# Altium schematic sheet DisplayLCD-RS485.SchDoc
size A0
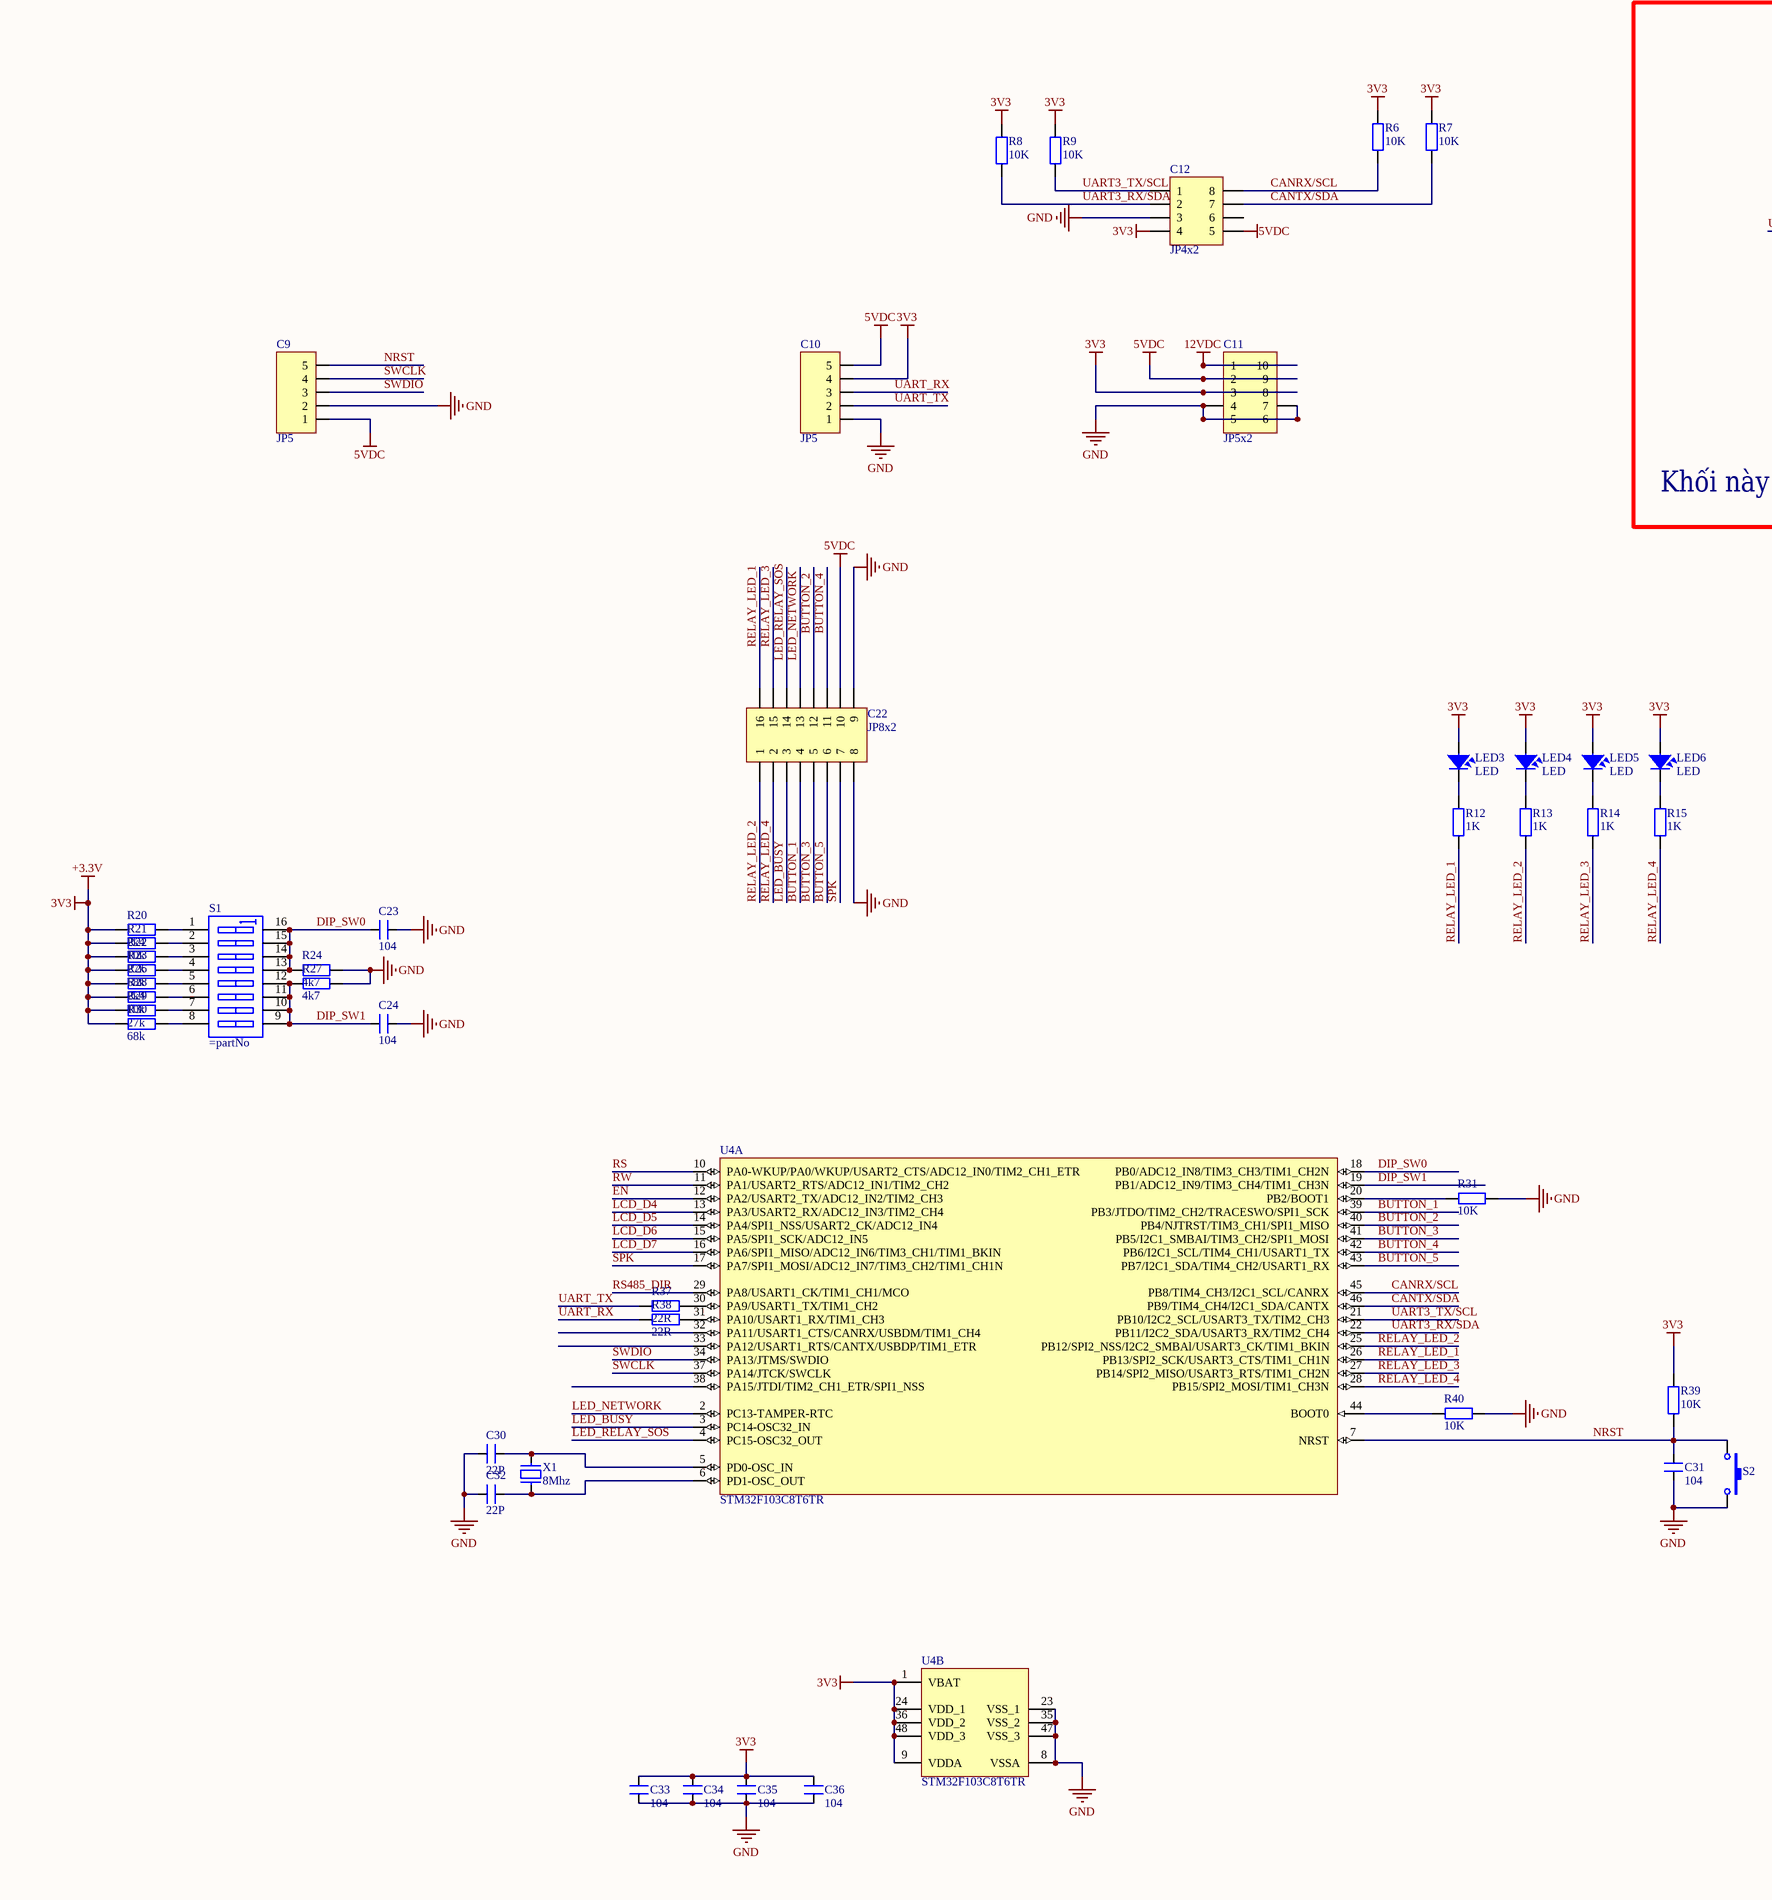
[diagram p0: DisplayLCD-RS485.SchDoc, left]
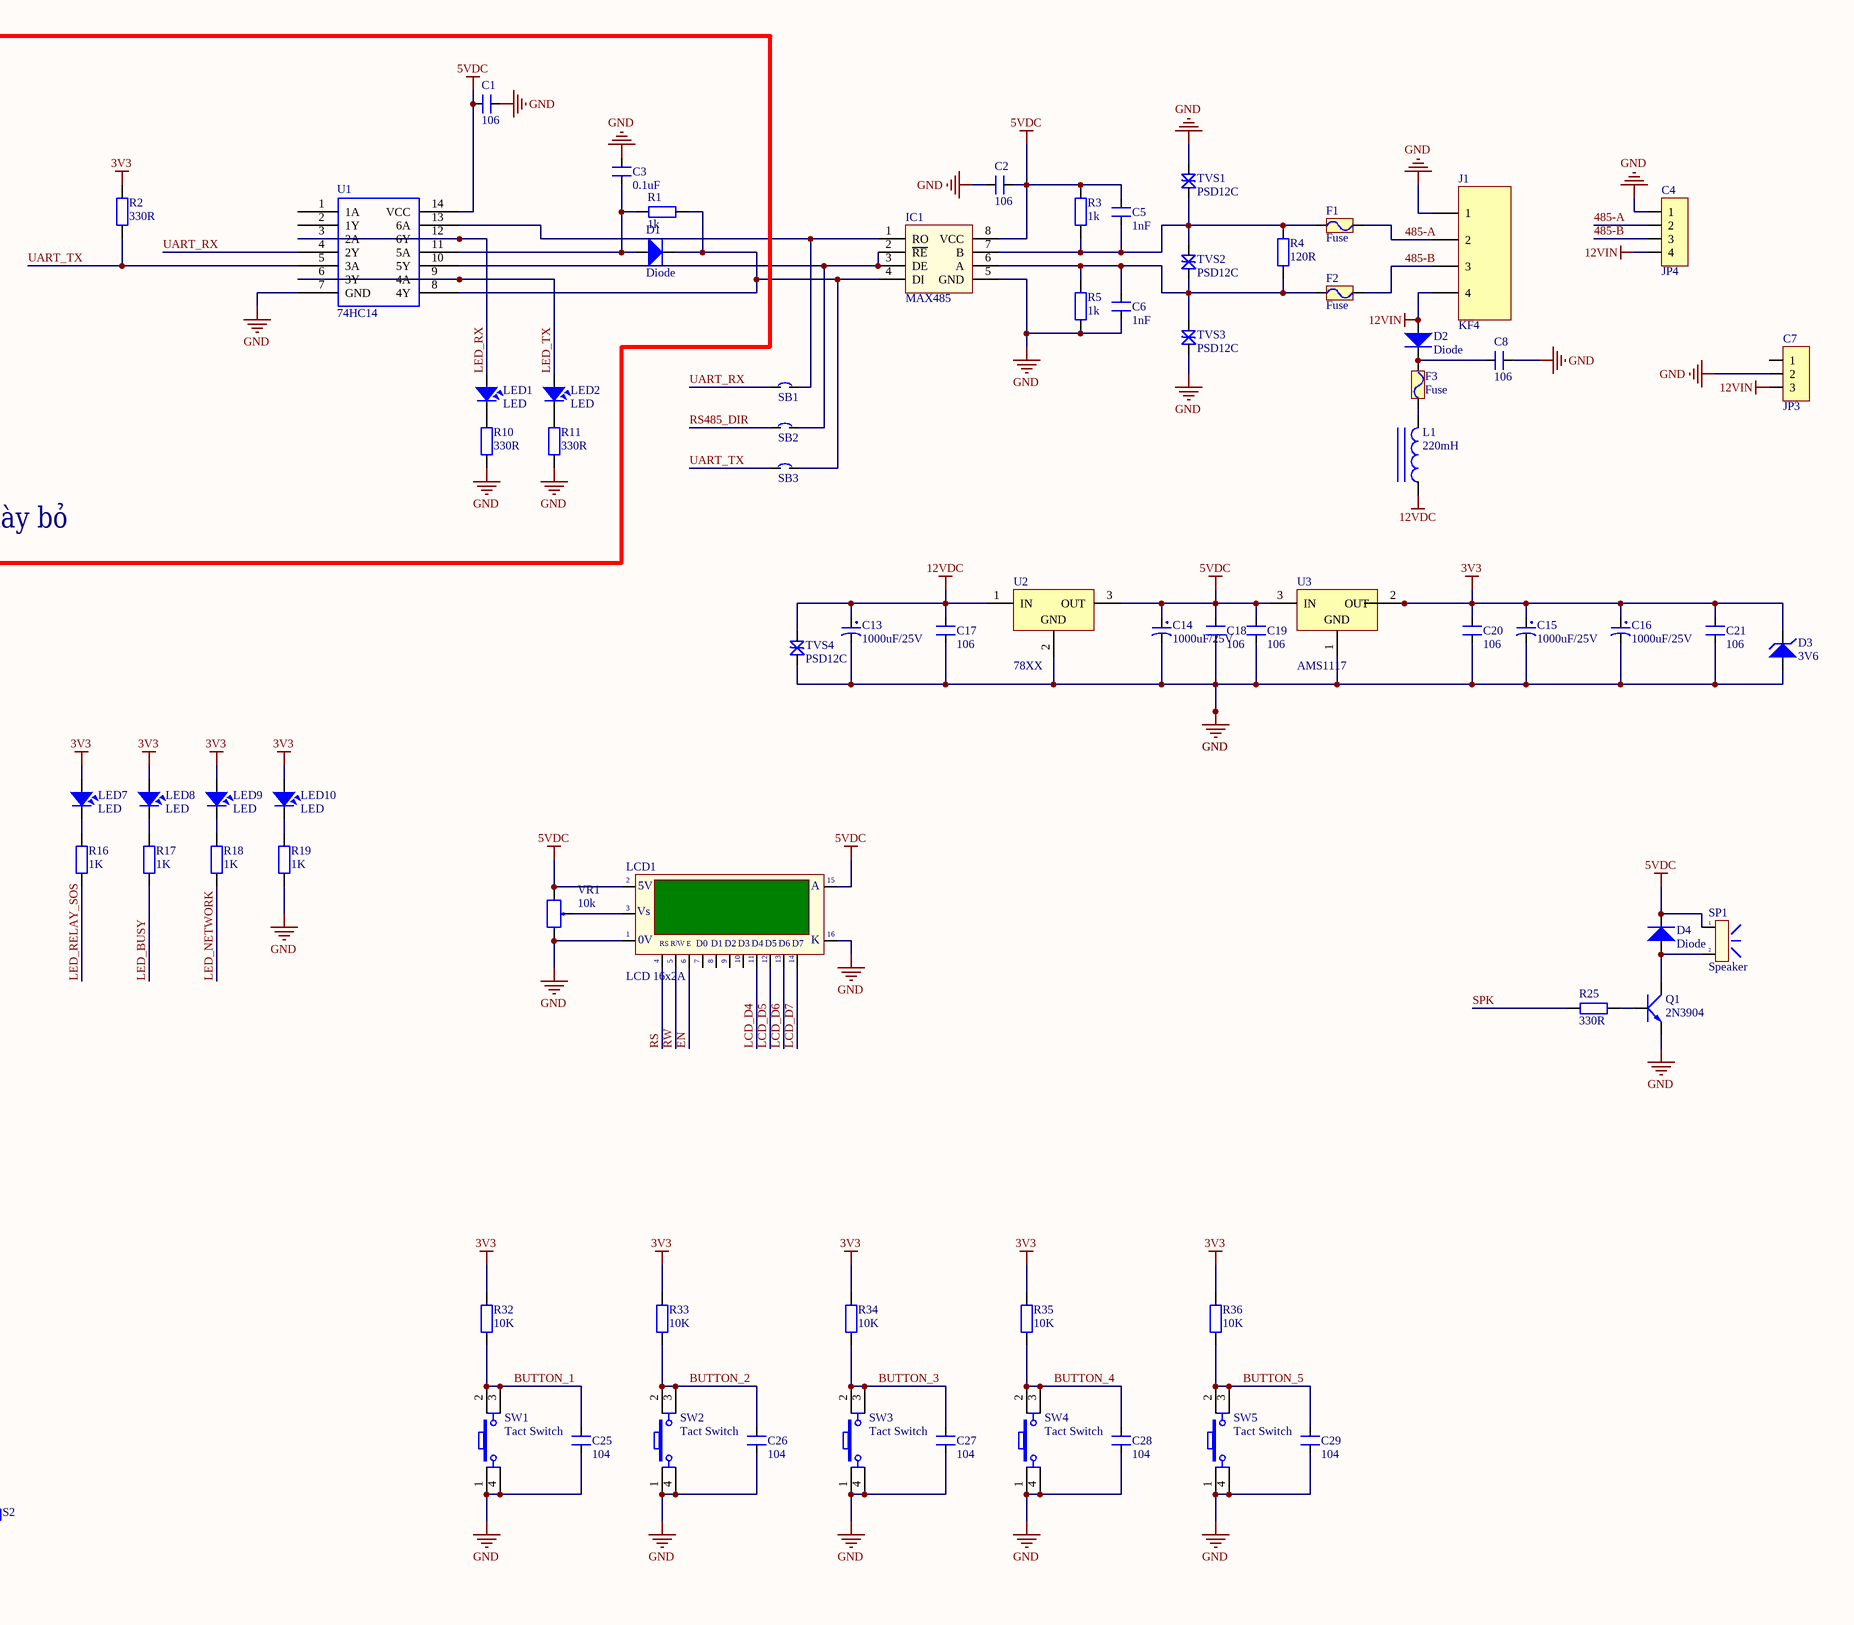
[diagram p1: DisplayLCD-RS485.SchDoc, right]

## Parts
C1  106  [SM-0805]
C2  106  [SM-0805]
C3  0.1uF  [SM-0805]
C4  JP4  [HDR2.54 4DV]
C5  1nF  [SM-0805]
C6  1nF  [SM-0805]
C7  JP3  [HDR2.54 3DV]
C8  106  [SM-0805]
C9  JP5  [JP5-C1T]
C10  JP5  [HDR2.54 5DV]
C11  JP5x2  [JP5-D2T]
C12  JP4x2  [JP4-D2T]
C13  1000uF/25V  [CP1.5/3.4]
C14  1000uF/25V  [CP1.5/3.4]
C15  1000uF/25V  [CP1.5/3.4]
C16  1000uF/25V  [CP1.5/3.4]
C17  106  [SM-0805]
C18  106  [SM-0805]
C19  106  [SM-0805]
C20  106  [SM-0805]
C21  106  [SM-0805]
C22  JP8x2  [61201621621]
C23  104  [SM-0805]
C24  104  [SM-0805]
C25  104  [SM-0805]
C26  104  [SM-0805]
C27  104  [SM-0805]
C28  104  [SM-0805]
C29  104  [SM-0805]
C30  22P  [SM-0805]
C31  104  [SM-0805]
C32  22P  [SM-0805]
C33  104  [SM-0805]
C34  104  [SM-0805]
C35  104  [SM-0805]
C36  104  [SM-0805]
D1  Diode  [DIO-SMD-106]
D2  Diode  [DIO-SMD-106]
D3  3V6  [SOD123]
D4  Diode  [DIO-SMD-106]
F1  Fuse  [RES-SMD-1812]
F2  Fuse  [RES-SMD-1812]
F3  Fuse  [RES-SMD-1812]
IC1  MAX485  [SO8]
J1  KF4  [KF4-5.08]
L1  220mH  [INDUCTOR 3A VERTICAL]
LCD1  LCD 16x2A  [LCD16X2]
LED1  LED  [SM-LED-0805-Green]
LED2  LED  [SM-LED-0805-Blue]
LED3  LED  [LED-5-BLUE]
LED4  LED  [LED-5-BLUE]
LED5  LED  [LED-5-BLUE]
LED6  LED  [LED-5-BLUE]
LED7  LED  [LED-5-BLUE]
LED8  LED  [LED-5-BLUE]
LED9  LED  [LED-5-BLUE]
LED10  LED  [LED-5-BLUE]
Q1  2N3904  [SOT23-231]
R1  1k  [RES-SMD-0805]
R2  330R  [RES-SMD-0805]
R3  1k  [RES-SMD-0805]
R4  120R  [RES-SMD-0805]
R5  1k  [RES-SMD-0805]
R6  10K  [RES-SMD-0805]
R7  10K  [RES-SMD-0805]
R8  10K  [RES-SMD-0805]
R9  10K  [RES-SMD-0805]
R10  330R  [RES-SMD-0805]
R11  330R  [RES-SMD-0805]
R12  1K  [RES-SMD-0805]
R13  1K  [RES-SMD-0805]
R14  1K  [RES-SMD-0805]
R15  1K  [RES-SMD-0805]
R16  1K  [RES-SMD-0805]
R17  1K  [RES-SMD-0805]
R18  1K  [RES-SMD-0805]
R19  1K  [RES-SMD-0805]
R20  2k4  [RES-SMD-0805]
R21  10k  [RES-SMD-0805]
R22  27k  [RES-SMD-0805]
R23  68k  [RES-SMD-0805]
R24  4k7  [RES-SMD-0805]
R25  330R  [RES-SMD-0805]
R26  2k4  [RES-SMD-0805]
R27  4k7  [RES-SMD-0805]
R28  10k  [RES-SMD-0805]
R29  27k  [RES-SMD-0805]
R30  68k  [RES-SMD-0805]
R31  10K  [RES-SMD-0805]
R32  10K  [RES-SMD-0805]
R33  10K  [RES-SMD-0805]
R34  10K  [RES-SMD-0805]
R35  10K  [RES-SMD-0805]
R36  10K  [RES-SMD-0805]
R37  22R  [RES-SMD-0805]
R38  22R  [RES-SMD-0805]
R39  10K  [RES-SMD-0805]
R40  10K  [RES-SMD-0805]
S1  (no value)  [SW-DIP8]
S2  SW  [BUTTON-SMD 2PIN]  (value not drawn)
SB1  SB  [SB]  (value not drawn)
SB2  SB  [SB]  (value not drawn)
SB3  SB  [SB]  (value not drawn)
SP1  Speaker  [SPK]
SW1  Tact Switch  [SW4_12X12_LAGER]
SW2  Tact Switch  [SW4_12X12_LAGER]
SW3  Tact Switch  [SW4_12X12_LAGER]
SW4  Tact Switch  [SW4_12X12_LAGER]
SW5  Tact Switch  [SW4_12X12_LAGER]
TVS1  PSD12C  [DIO-SMD-B]
TVS2  PSD12C  [DIO-SMD-B]
TVS3  PSD12C  [DIO-SMD-B]
TVS4  PSD12C  [DIO-SMD-B]
U1  74HC14  [SO14]
U2  78XX  [TO252-123]
U3  AMS1117  [SOT223]
U4  STM32F103C8T6TR  [STM-LQFP48_N]  (parts A,B of 2)
VR1  10k  [VR-S2]
X1  8Mhz  [XT2]

## Nets
5VDC: C1.2 C2.1 C5.2 C9.1 C10.5 C11.2 C11.9 C12.5 C14.1 C18.1 C19.1 C22.10 D4.2 IC1.8(VCC) LCD1.2(VDD) LCD1.15(A) R3.2 SP1.1 U1.14(VCC) U2.3(OUT) U3.3(IN) VR1.1
12VDC: C11.1 C11.10 C13.1 C17.1 L1.1 TVS4.2 U2.1(IN)
12VIN: C4.4 C7.3 D2.1 J1.4
+3.3V: C10.4 C11.3 C11.8 C12.4 C15.1 C16.1 C20.1 C21.1 C33.1 C34.1 C35.1 C36.1 D3.2 LED3.1 LED4.1 LED5.1 LED6.1 LED7.1 LED8.1 LED9.1 LED10.1 R2.1 R6.1 R7.1 R8.1 R9.1 R20.2 R21.2 R22.2 R23.2 R26.2 R28.2 R29.2 R30.2 R32.1 R33.1 R34.1 R35.1 R36.1 R39.1 U3.2(OUT) U3.4 U4.1(VBAT) U4.9(VDDA) U4.24(VDD_1) U4.36(VDD_2) U4.48(VDD_3)  [also labelled 3V3]
GND: C1.1 C2.2 C3.1 C4.1 C6.1 C7.2 C8.2 C9.2 C10.1 C11.4 C11.5 C11.6 C11.7 C12.3 C13.2 C14.2 C15.2 C16.2 C17.2 C18.2 C19.2 C20.2 C21.2 C22.8 C22.9 C23.1 C24.1 C25.1 C26.1 C27.1 C28.1 C29.1 C30.2 C31.1 C32.2 C33.2 C34.2 C35.2 C36.2 D3.1 IC1.5(GND) J1.1 LCD1.1(GND) LCD1.16(K) Q1.1(E) R5.1 R10.2 R11.2 R19.2 R24.1 R27.1 R31.2 R40.2 S2.2 SW1.1 SW1.4 SW2.1 SW2.4 SW3.1 SW3.4 SW4.1 SW4.4 SW5.1 SW5.4 TVS1.2 TVS3.1 TVS4.1 U1.7(GND) U2.2(GND) U3.1(GND) U4.8(VSSA) U4.23(VSS_1) U4.35(VSS_2) U4.47(VSS_3) VR1.3
485-A: C4.2 F1.2 J1.2
485-B: C4.3 F2.2 J1.3
BUTTON_1: C22.4 C25.2 R32.2 SW1.2 SW1.3 U4.39(PB3/JTDO/TIM2_CH2/TRACESWO/SPI1_SCK)
BUTTON_2: C22.12 C26.2 R33.2 SW2.2 SW2.3 U4.40(PB4/NJTRST/TIM3_CH1/SPI1_MISO)
BUTTON_3: C22.5 C27.2 R34.2 SW3.2 SW3.3 U4.41(PB5/I2C1_SMBAI/TIM3_CH2/SPI1_MOSI)
BUTTON_4: C22.11 C28.2 R35.2 SW4.2 SW4.3 U4.42(PB6/I2C1_SCL/TIM4_CH1/USART1_TX)
BUTTON_5: C22.6 C29.2 R36.2 SW5.2 SW5.3 U4.43(PB7/I2C1_SDA/TIM4_CH2/USART1_RX)
CANRX/SCL: C12.8 R6.2 U4.45(PB8/TIM4_CH3/I2C1_SCL/CANRX)
CANTX/SDA: C12.7 R7.2 U4.46(PB9/TIM4_CH4/I2C1_SDA/CANTX)
DIP_SW0: C23.2 R24.2 S1.13 S1.14 S1.15 S1.16 U4.18(PB0/ADC12_IN8/TIM3_CH3/TIM1_CH2N)
DIP_SW1: C24.2 R27.2 S1.9 S1.10 S1.11 S1.12 U4.19(PB1/ADC12_IN9/TIM3_CH4/TIM1_CH3N)
EN: LCD1.6(~{EN}) U4.12(PA2/USART2_TX/ADC12_IN2/TIM2_CH3)
LCD_D4: LCD1.11(D4) U4.13(PA3/USART2_RX/ADC12_IN3/TIM2_CH4)
LCD_D5: LCD1.12(D5) U4.14(PA4/SPI1_NSS/USART2_CK/ADC12_IN4)
LCD_D6: LCD1.13(D6) U4.15(PA5/SPI1_SCK/ADC12_IN5)
LCD_D7: LCD1.14(D7) U4.16(PA6/SPI1_MISO/ADC12_IN6/TIM3_CH1/TIM1_BKIN)
LED_BUSY: C22.3 R17.2 U4.3(PC14-OSC32_IN)
LED_NETWORK: C22.13 R18.2 U4.2(PC13-TAMPER-RTC)
LED_RELAY_SOS: C22.14 R16.2 U4.4(PC15-OSC32_OUT)
LED_RX: LED1.1 U1.3(2A) U1.12(6Y)
LED_TX: LED2.1 U1.6(3Y) U1.9(4A)
NRST: C9.5 C31.2 R39.2 S2.1 U4.7(NRST)
RELAY_LED_1: C22.16 R12.2 U4.26(PB13/SPI2_SCK/USART3_CTS/TIM1_CH1N)
RELAY_LED_2: C22.1 R13.2 U4.25(PB12/SPI2_NSS/I2C2_SMBAl/USART3_CK/TIM1_BKIN)
RELAY_LED_3: C22.15 R14.2 U4.27(PB14/SPI2_MISO/USART3_RTS/TIM1_CH2N)
RELAY_LED_4: C22.2 R15.2 U4.28(PB15/SPI2_MOSI/TIM1_CH3N)
RS: LCD1.4(RS) U4.10(PA0-WKUP/PA0/WKUP/USART2_CTS/ADC12_IN0/TIM2_CH1_ETR)
RS485_DIR: SB2.1 U4.29(PA8/USART1_CK/TIM1_CH1/MCO)
RW: LCD1.5(R/~{W}) U4.11(PA1/USART2_RTS/ADC12_IN1/TIM2_CH2)
SPK: C22.7 R25.1 U4.17(PA7/SPI1_MOSI/ADC12_IN7/TIM3_CH2/TIM1_CH1N)
SWCLK: C9.4 U4.37(PA14/JTCK/SWCLK)
SWDIO: C9.3 U4.34(PA13/JTMS/SWDIO)
UART3_RX/SDA: C12.2 R8.2 U4.22(PB11/I2C2_SDA/USART3_RX/TIM2_CH4)
UART3_TX/SCL: C12.1 R9.2 U4.21(PB10/I2C2_SCL/USART3_TX/TIM2_CH3)
UART_RX: C10.3 R38.1 SB1.1 U1.4(2Y)
UART_TX: C10.2 R2.2 R37.1 SB3.1 U1.5(3A)
NetC3_2: C3.2 D1.1 R1.2 U1.11(5A)
NetC5_1: C5.1 F1.1 IC1.7(B) R3.1 R4.2 TVS1.1 TVS2.2
NetC6_2: C6.2 F2.1 IC1.6(A) R4.1 R5.2 TVS2.1 TVS3.2
NetC8_1: C8.1 D2.2 F3.2
NetC30_1: C30.1 U4.5(PD0-OSC_IN) X1.1
NetC32_1: C32.1 U4.6(PD1-OSC_OUT) X1.2
NetD1_2: D1.2 IC1.4(DI) R1.1 SB3.2 U1.8(4Y)
NetD4_1: D4.1 Q1.3(C) SP1.2
NetF3_1: F3.1 L1.2
NetIC1_1: IC1.1(RO) SB1.2 U1.13(6A)
NetIC1_2: IC1.2(~{RE}) IC1.3(DE) SB2.2 U1.10(5Y)
NetLCD1_3: LCD1.3(VEE) VR1.2
NetLED1_2: LED1.2 R10.1
NetLED2_2: LED2.2 R11.1
NetLED3_2: LED3.2 R12.1
NetLED4_2: LED4.2 R13.1
NetLED5_2: LED5.2 R14.1
NetLED6_2: LED6.2 R15.1
NetLED7_2: LED7.2 R16.1
NetLED8_2: LED8.2 R17.1
NetLED9_2: LED9.2 R18.1
NetLED10_2: LED10.2 R19.1
NetQ1_2: Q1.2(B) R25.2
NetR20_1: R20.1 S1.1
NetR21_1: R21.1 S1.2
NetR22_1: R22.1 S1.3
NetR23_1: R23.1 S1.4
NetR26_1: R26.1 S1.5
NetR28_1: R28.1 S1.6
NetR29_1: R29.1 S1.7
NetR30_1: R30.1 S1.8
NetR31_1: R31.1 U4.20(PB2/BOOT1)
NetR37_2: R37.2 U4.30(PA9/USART1_TX/TIM1_CH2)
NetR38_2: R38.2 U4.31(PA10/USART1_RX/TIM1_CH3)
NetR40_1: R40.1 U4.44(BOOT0)

Not connected (* = marked no-connect by the designer): C7 1; C12 6; LCD1 7(D0) 8(D1) 9(D2) 10(D3); U1 1(1A) 2(1Y); U4 32(PA11/USART1_CTS/CANRX/USBDM/TIM1_CH4) 33(PA12/USART1_RTS/CANTX/USBDP/TIM1_ETR) 38(PA15/JTDI/TIM2_CH1_ETR/SPI1_NSS)

## Notes on the sheet
- Khối này bỏ
- (in symbol LCD16x2A) 5V; Vs; |; 0V; R/W; E

## Library data of the parts
C1-C3 C5 C6 C8 C17-C21 C23-C36 = CM: Cap SMD; Value: 103
C4 = JP4: WR-PHD 2.54 mm Angled Socket Header; Manufacturer: W¨¹rth Elektronik eiSos GmbH; partNo: 613004143121; ComponentLink1 Description: Manufacturer; ComponentLink2 Description: Datasheet; NoPins: 04; Created Date: 29 March 2013; ComponentLink1URL: http://www.we-online.com; ComponentLink2URL: http://katalog.we-online.de/em/datasheet/6130xx143121.pdf; Created by: Karrer Zheng
C7 = JP3: WR-PHD 2.54 mm Angled Socket Header; Manufacturer: W¨¹rth Elektronik eiSos GmbH; partNo: 613003143121; ComponentLink1 Description: Manufacturer; ComponentLink2 Description: Datasheet; NoPins: 03; Created Date: 29 March 2013; ComponentLink1URL: http://www.we-online.com; ComponentLink2URL: http://katalog.we-online.de/em/datasheet/6130xx143121.pdf; Created by: Karrer Zheng
C9 C10 = JP5: WR-PHD 2.54 mm Angled Socket Header; Manufacturer: W¨¹rth Elektronik eiSos GmbH; partNo: 613005143121; ComponentLink1 Description: Manufacturer; ComponentLink2 Description: Datasheet; NoPins: 05; Created Date: 29 March 2013; ComponentLink1URL: http://www.we-online.com; ComponentLink2URL: http://katalog.we-online.de/em/datasheet/6130xx143121.pdf; Created by: Karrer Zheng
C11 = JP5x2: WR-PHD 2.54 mm Dual Socket Header; Manufacturer: W¨¹rth Elektronik eiSos GmbH; partNo: 61301021821; ComponentLink1 Description: Manufacturer; ComponentLink2 Description: Datasheet; NoPins: 10; Created Date: 29 March 2013; ComponentLink1URL: http://www.we-online.com; ComponentLink2URL: http://katalog.we-online.de/em/datasheet/6130xx21821.pdf; Created by: Karrer Zheng
C12 = JP4x2: WR-PHD 2.54 mm Dual Socket Header; Manufacturer: W¨¹rth Elektronik eiSos GmbH; partNo: 61300821821; ComponentLink1 Description: Manufacturer; ComponentLink2 Description: Datasheet; NoPins: 08; Created Date: 29 March 2013; ComponentLink1URL: http://www.we-online.com; ComponentLink2URL: http://katalog.we-online.de/em/datasheet/6130xx21821.pdf; Created by: Karrer Zheng
C13-C16 = CP4: Cap 1000uF/16V - 220uF/50V; Description 5: 4,7uF>10uF/250V_3,3uF>10uF/400V - 2,2uF>4,7uF/450V; Description 1: 2200uF-3300uF/6,3V - 1000uF-2200uF/10V; Description 2: 1000uF/16V - 470uF => 1000uF/25V - 100uF/100V; Description 3: 330uF>470uF/35V_220uF>470uF/50V_10uF>22uF/250V; Description 4: 220uF => 330uF/63V - 10uF =>33uF/160 - 200V; Value: 1000uF/16V
C22 = JP8x2: WR-PHD 2.54 mm Dual Socket Header; Manufacturer: W¨¹rth Elektronik eiSos GmbH; partNo: 61301621821; ComponentLink1 Description: Manufacturer; ComponentLink2 Description: Datasheet; NoPins: 16; Created Date: 29 March 2013; ComponentLink1URL: http://www.we-online.com; ComponentLink2URL: http://katalog.we-online.de/em/datasheet/6130xx21821.pdf; Created by: Karrer Zheng
D3 = Diode Zener: Part Number: BZV55-C5V1; Pricing: *
IC1 = MAX485: RS232 - RS485 (Same sn75176)
J1 = KF4: Manufacturer: W¨¹rth Elektronik eiSos GmbH; PartNo: 691133710004; ComponentLink1 Description: Manufacturer; ComponentLink2 Description: Datasheet; NoPins: 4; ComponentLink1 URL: http://www.we-online.com; ComponentLink2 URL: http://katalog.we-online.de/em/datasheet/6911337100xx.pdf; Created By: Baojun Chen; Created Date: 4-Aug-15
L1 = Inductor Iron: Magnetic-Core Inductor; Value: 150 mH
LCD1 = LCD16x2A: LCD dipslay 16 char, 2 line; Value: LCD16x2A
Q1 = 2N3904: NPN 600mW, ECB; Value: C1815
R1-R40 = R: Resistor R1/4W
S1 = SWDIP8: WS-DITV 2.54 mm small compact THT flat actuator with top tape; Manufacturer: Wurth Elektronik; Part No.: 418127160908; ComponentLink1 Description: Manufacturer; ComponentLink2 Description: Datasheet; Pole: 08; Created Date: Dec.2015; ComponentLink1URL: http://www.we-online.com; ComponentLink2URL: http://katalog.we-online.de/em/datasheet/4181271609xx.pdf; Created by: Baojun Chen
S2 = SW-Button: Switch-Button; Published: 24-Mar-1999; LatestRevisionDate: 17-Jul-2002; LatestRevisionNote: Re-released for DXP Platform.; PackageReference: SPST-2; Publisher: Altium Limited
SP1 = SPK: Speaker Chip; Value: Speaker Chip
SW1-SW5 = SW4: Value: Button chip 4 pin
TVS1-TVS4 = Diode TVS
U2 = LM78XX
U3 = AMS117
U4 = STM32F103C8T6TR: ARM Cortex-M3 32-bit MCU, 64 KB Flash, 20 KB Internal RAM, 37 I/Os, 48-pin LQFP, -40 to 85 degC, Tape and Reel; A/D Converter: 2x12-bit (10 Channel); FLASH Size (Prog) (kB): 64; I/Os (High Current): 37; Internal RAM Size (kB): 20; Operating Frequency(F) (Processor speed) (MHz): 72; Supply Voltage(Vcc) min (V): 2; DatasheetVersion: Rev. 16; PackageVersion: Rev. 6, 06/2013; PackageReference: LQFP48; PackageDescription: 48-Pin Low Profile Quad Flat Package, 7 x 7 mm Body, 0.5 mm Pitch; Supplier 1: Digi-Key; Supplier Part Number 1: STM32F103C8T6TR-ND; Supplier 2: Mouser; Supplier Part Number 2: 511-STM32F103C8T6TR; Core: ARM Cortex-M3; Packing: Tape and Reel; Mounting Technology: Surface Mount; PartNumber: STM32F103C8T6TR; ComponentLink1Description: Manufacturer URL; ComponentLink1URL: http://www.st.com/web/en/home.html; ComponentLink2Description: Datasheet; ComponentLink2URL: http://www.st.com/st-web-ui/static/active/en/resource/technical/document/datasheet/CD00161566.pdf; ComponentLink3Description: Package Specification; ComponentLink3URL: http://www.st.com/st-web-ui/static/active/en/resource/technical/document/datasheet/DM00058181.pdf
VR1 = Resistor Var
X1 = XT2: Crystal, 32.768 KHz, -40 to 85 degC, 3.2 x 1.5 x 0.9 mm SMD; Value: 4Mhz